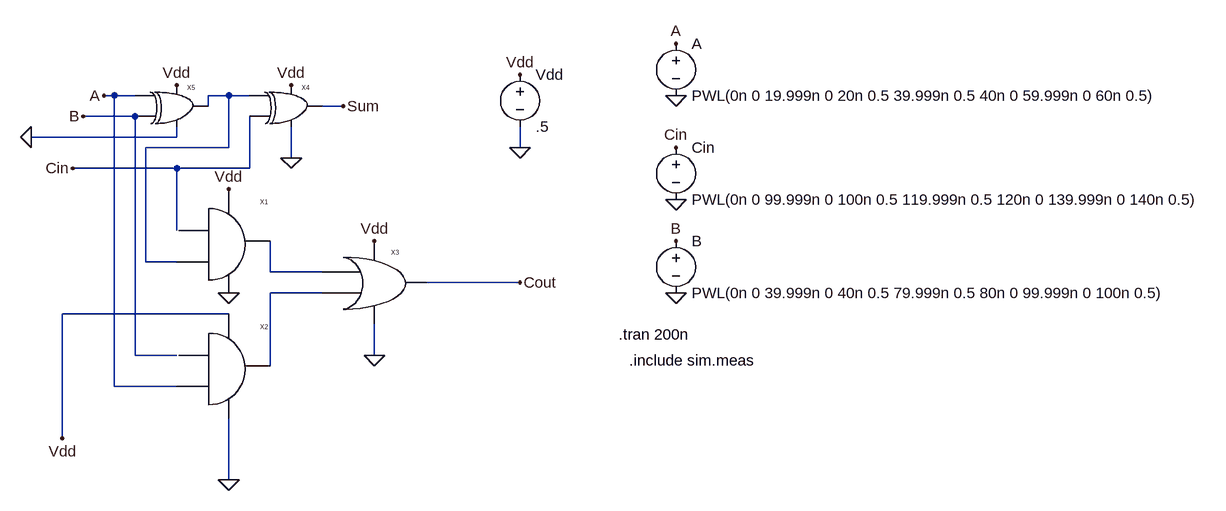
[diagram p0: schematic CMOS_FULL_ADDER.asc]
CMOS_FULL_ADDER.asc, the LTspice schematic file:
Version 4.1
SHEET 1 2064 680
WIRE 176 -80 160 -80
WIRE 208 -80 176 -80
WIRE 352 -80 320 -80
WIRE 384 -80 352 -80
WIRE 320 -64 320 -80
WIRE 528 -64 496 -64
WIRE 208 -48 128 -48
WIRE 272 -16 272 -32
WIRE 272 -16 48 -16
WIRE 352 0 352 -80
WIRE 352 0 224 0
WIRE 800 0 800 -32
WIRE 448 16 448 -32
WIRE 272 32 112 32
WIRE 384 32 384 -48
WIRE 384 32 272 32
WIRE 272 128 272 32
WIRE 224 176 224 0
WIRE 272 176 224 176
WIRE 416 192 416 144
WIRE 496 192 416 192
WIRE 800 208 656 208
WIRE 496 224 416 224
WIRE 352 256 96 256
WIRE 208 320 208 -48
WIRE 272 320 208 320
WIRE 576 320 576 272
WIRE 416 336 416 224
WIRE 176 368 176 -80
WIRE 272 368 176 368
WIRE 96 448 96 256
WIRE 352 512 352 416
FLAG 160 -80 A
FLAG 128 -48 B
FLAG 112 32 Cin
FLAG 576 144 Vdd
FLAG 352 64 Vdd
FLAG 448 -96 Vdd
FLAG 272 -96 Vdd
FLAG 528 -64 Sum
FLAG 96 448 Vdd
FLAG 800 208 Cout
FLAG 448 16 0
FLAG 576 320 0
FLAG 352 512 0
FLAG 352 224 0
FLAG 48 -16 0
FLAG 800 0 0
FLAG 800 -112 Vdd
FLAG 1040 224 0
FLAG 1040 -80 0
FLAG 1040 -160 A
FLAG 1040 144 B
FLAG 1040 80 0
FLAG 1040 0 Cin
SYMBOL CMOS_AND 240 160 R0
SYMATTR InstName X1
SYMBOL CMOS_AND 240 352 R0
SYMATTR InstName X2
SYMBOL CMOS_OR 608 208 R0
SYMATTR InstName X3
SYMBOL CMOS_XOR 400 -48 R0
SYMATTR InstName X4
SYMBOL CMOS_XOR 224 -48 R0
SYMATTR InstName X5
SYMBOL voltage 800 -128 R0
SYMATTR InstName Vdd
SYMATTR Value .5
SYMBOL voltage 1040 -176 R0
WINDOW 123 0 0 Left 0
WINDOW 39 0 0 Left 0
SYMATTR InstName A
SYMATTR Value PWL(0n 0 19.999n 0 20n 0.5 39.999n 0.5 40n 0 59.999n 0 60n 0.5)
SYMBOL voltage 1040 128 R0
WINDOW 123 0 0 Left 0
WINDOW 39 0 0 Left 0
SYMATTR InstName B
SYMATTR Value PWL(0n 0 39.999n 0 40n 0.5 79.999n 0.5 80n 0 99.999n 0 100n 0.5)
SYMBOL voltage 1040 -16 R0
WINDOW 123 0 0 Left 0
WINDOW 39 0 0 Left 0
SYMATTR InstName Cin
SYMATTR Value PWL(0n 0 99.999n 0 100n 0.5 119.999n 0.5 120n 0 139.999n 0 140n 0.5)
TEXT 952 288 Left 2 !.tran 200n
TEXT 968 328 Left 2 !.include sim.meas

The netlist it stands for:
* CMOS_FULL_ADDER.asc
X§X1 Vdd Cin N001 N002 0 CMOS_AND  ; pins Vdd A B out ground
X§X2 Vdd B A N003 0 CMOS_AND  ; pins Vdd A B out ground
X§X3 Cout Vdd 0 N002 N003 CMOS_OR  ; pins out Vdd ground A B
X§X4 Sum Vdd N001 Cin 0 CMOS_XOR  ; pins out Vdd A B ground
X§X5 N001 Vdd A B 0 CMOS_XOR  ; pins out Vdd A B ground
Vdd Vdd 0 .5
V§A A 0 PWL(0n 0 19.999n 0 20n 0.5 39.999n 0.5 40n 0 59.999n 0 60n 0.5)
V§B B 0 PWL(0n 0 39.999n 0 40n 0.5 79.999n 0.5 80n 0 99.999n 0 100n 0.5)
V§Cin Cin 0 PWL(0n 0 99.999n 0 100n 0.5 119.999n 0.5 120n 0 139.999n 0 140n 0.5)
.tran 200n
.include sim.meas
.backanno
.end